# Altium schematic sheet Buttoninterface.SchDoc
size A4
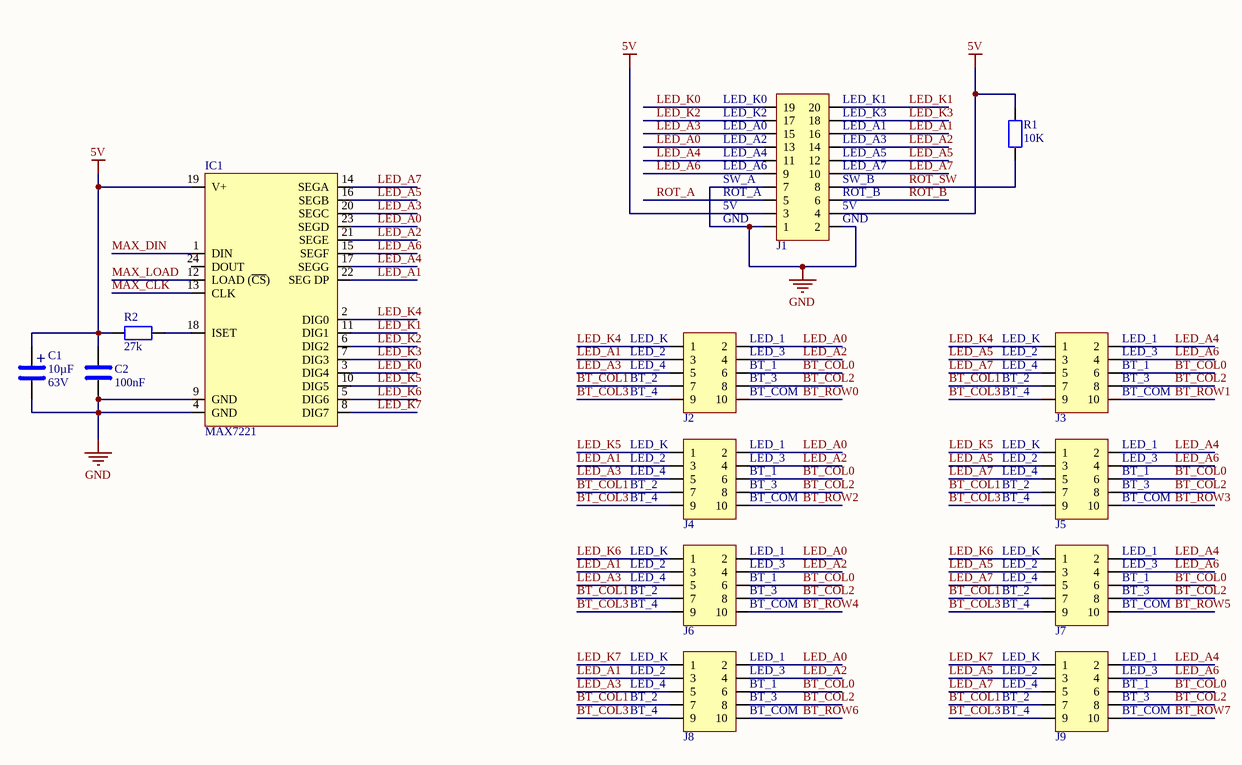
[diagram p0: Buttoninterface.SchDoc]

## Parts
C1  value 10µF  voltage: 63V  [RM2D5H11]  (hidden comment: Elko_10uF_63V)
C2  value 100nF  [0805]  (hidden comment: 100nF 50V MLCC 0805)
IC1  MAX7221  [DIL28]
J1  Wannenstecker 20pol 2,54mm  [WSL20G]  (value not drawn)
J2  Wannenstecker 10pol 2,54mm  [WSL10G]  (value not drawn)
J3  Wannenstecker 10pol 2,54mm  [WSL10G]  (value not drawn)
J4  Wannenstecker 10pol 2,54mm  [WSL10G]  (value not drawn)
J5  Wannenstecker 10pol 2,54mm  [WSL10G]  (value not drawn)
J6  Wannenstecker 10pol 2,54mm  [WSL10G]  (value not drawn)
J7  Wannenstecker 10pol 2,54mm  [WSL10G]  (value not drawn)
J8  Wannenstecker 10pol 2,54mm  [WSL10G]  (value not drawn)
J9  Wannenstecker 10pol 2,54mm  [WSL10G]  (value not drawn)
R1  value 10K  [res0805]  (hidden comment: 10K 125mW 0805)
R2  value 27k  [res0805]  (hidden comment: 27k 125mW 0805)

## Nets
5V: C1.+ C2.2 IC1.19(V+) J1.3 J1.4 R1.2 R2.2
GND: C1.- C2.1 IC1.4(GND) IC1.9(GND) J1.1 J1.2 J1.7
BT_COL0: J2.6 J3.6 J4.6 J5.6 J6.6 J7.6 J8.6 J9.6
BT_COL1: J2.7 J3.7 J4.7 J5.7 J6.7 J7.7 J8.7 J9.7
BT_COL2: J2.8 J3.8 J4.8 J5.8 J6.8 J7.8 J8.8 J9.8
BT_COL3: J2.9 J3.9 J4.9 J5.9 J6.9 J7.9 J8.9 J9.9
BT_ROW0: J2.10
BT_ROW1: J3.10
BT_ROW2: J4.10
BT_ROW3: J5.10
BT_ROW4: J6.10
BT_ROW5: J7.10
BT_ROW6: J8.10
BT_ROW7: J9.10
LED_A0: IC1.23(SEGD) J1.13 J2.2 J4.2 J6.2 J8.2
LED_A1: IC1.22(SEG_DP) J1.16 J2.3 J4.3 J6.3 J8.3
LED_A2: IC1.21(SEGE) J1.14 J2.4 J4.4 J6.4 J8.4
LED_A3: IC1.20(SEGC) J1.15 J2.5 J4.5 J6.5 J8.5
LED_A4: IC1.17(SEGG) J1.11 J3.2 J5.2 J7.2 J9.2
LED_A5: IC1.16(SEGB) J1.12 J3.3 J5.3 J7.3 J9.3
LED_A6: IC1.15(SEGF) J1.9 J3.4 J5.4 J7.4 J9.4
LED_A7: IC1.14(SEGA) J1.10 J3.5 J5.5 J7.5 J9.5
LED_K0: IC1.3(DIG4) J1.19
LED_K1: IC1.11(DIG1) J1.20
LED_K2: IC1.6(DIG2) J1.17
LED_K3: IC1.7(DIG3) J1.18
LED_K4: IC1.2(DIG0) J2.1 J3.1
LED_K5: IC1.10(DIG5) J4.1 J5.1
LED_K6: IC1.5(DIG6) J6.1 J7.1
LED_K7: IC1.8(DIG7) J8.1 J9.1
MAX_CLK: IC1.13(CLK)
MAX_DIN: IC1.1(DIN)
MAX_LOAD: IC1.12(LOAD_(~{CS}))
ROT_A: J1.5
ROT_B: J1.6
ROT_SW: J1.8 R1.1
NetIC1_18: IC1.18(ISET) R2.1

Not connected (* = marked no-connect by the designer): IC1 24(DOUT)

## Notes on the sheet
- (near J1) LED_K0
- (near J1) LED_K2
- (near J1) LED_A0
- (near J1) LED_A2
- (near J1) LED_K1
- (near J1) LED_K3
- (near J1) LED_A1
- (near J1) LED_A3
- (near J1) LED_A4
- (near J1) LED_A6
- (near J1) ROT_A
- (near J1) SW_A
- (near J1) 5V
- (near J1) LED_A5
- (near J1) LED_A7
- (near J1) ROT_B
- (near J1) SW_B
- (near J1) GND
- (near J2) LED_K
- (near J2) LED_1
- (near J3) LED_K
- (near J3) LED_1
- (near J2) LED_2
- (near J2) LED_4
- (near J2) BT_2
- (near J2) BT_4
- (near J2) LED_3
- (near J2) BT_1
- (near J2) BT_3
- (near J2) BT_COM
- (near J3) LED_2
- (near J3) LED_4
- (near J3) BT_2
- (near J3) BT_4
- (near J3) LED_3
- (near J3) BT_1
- (near J3) BT_3
- (near J3) BT_COM
- (near J4) LED_K
- (near J4) LED_2
- (near J4) LED_4
- (near J4) LED_1
- (near J4) LED_3
- (near J4) BT_1
- (near J5) LED_K
- (near J5) LED_2
- (near J5) LED_4
- (near J5) LED_1
- (near J5) LED_3
- (near J5) BT_1
- (near J4) BT_2
- (near J4) BT_4
- (near J6) LED_K
- (near J4) BT_3
- (near J4) BT_COM
- (near J6) LED_1
- (near J5) BT_2
- (near J5) BT_4
- (near J7) LED_K
- (near J5) BT_3
- (near J5) BT_COM
- (near J7) LED_1
- (near J6) LED_2
- (near J6) LED_4
- (near J6) BT_2
- (near J6) BT_4
- (near J6) LED_3
- (near J6) BT_1
- (near J6) BT_3
- (near J6) BT_COM
- (near J7) LED_2
- (near J7) LED_4
- (near J7) BT_2
- (near J7) BT_4
- (near J7) LED_3
- (near J7) BT_1
- (near J7) BT_3
- (near J7) BT_COM
- (near J8) LED_K
- (near J8) LED_2
- (near J8) LED_4
- (near J8) LED_1
- (near J8) LED_3
- (near J8) BT_1
- (near J9) LED_K
- (near J9) LED_2
- (near J9) LED_4
- (near J9) LED_1
- (near J9) LED_3
- (near J9) BT_1
- (near J8) BT_2
- (near J8) BT_4
- (near J8) BT_3
- (near J8) BT_COM
- (near J9) BT_2
- (near J9) BT_4
- (near J9) BT_3
- (near J9) BT_COM

## Library data of the parts
C1 = Elko_10uF_63V: reichelt code: RAD 105 10/63
C2 = 100nF 50V MLCC 0805: Reichelt code: X7R-G0805 100N; dielectricum: X7R; voltage: 50V
IC1 = MAX7221CNG: 8x8 Matrix LED driver; reichelt code: MAX 7221 CNG
J1 = Wannenstecker 20pol 2,54mm: Reichelt code: WSL 20G
J2-J9 = Wannenstecker 10pol 2,54mm: Reichelt code: WSL 10G
R1 = 10K 125mW 0805: Tolerance: 1%; Reichelt code: SMD-0805 10,0K; Power rating: 125mW
R2 = 27k 125mW 0805: Tolerance: 1%; Reichelt code: SMD-0805 27,0K; Power rating: 125mW